# EAGLE design M119B (EAGLE 6.6.0)
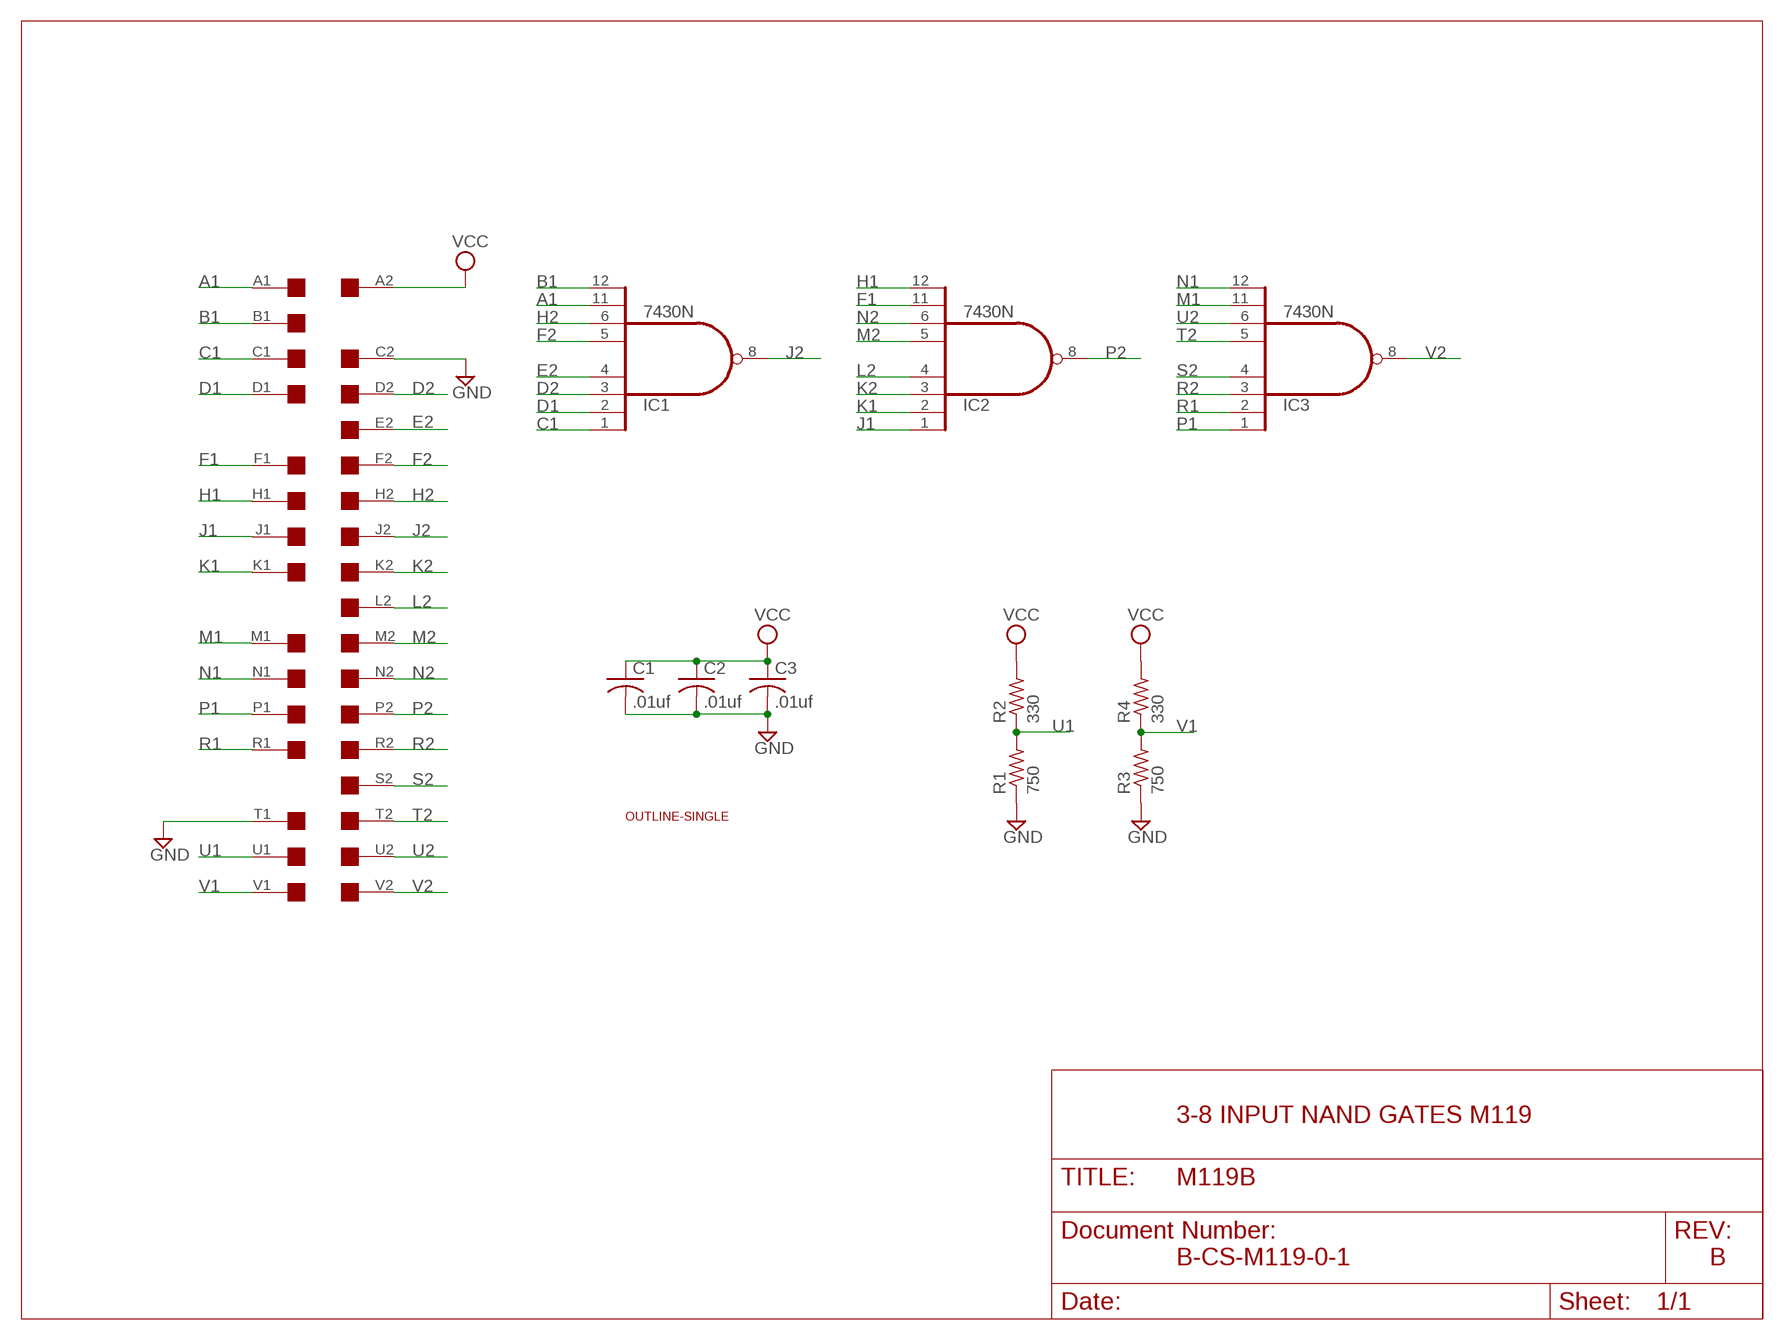
[diagram p0: schematic, sheet 1]

## Parts
C1  .01uf  C-US050-025X075  [C050-025X075]
C2  .01uf  C-US050-025X075  [C050-025X075]
C3  .01uf  C-US050-025X075  [C050-025X075]
IC1  7430N  [DIL14]
IC2  7430N  [DIL14]
IC3  7430N  [DIL14]
R1  750  R-US_0207/10  [0207/10]
R2  330  R-US_0207/10  [0207/10]
R3  750  R-US_0207/10  [0207/10]
R4  330  R-US_0207/10  [0207/10]
U$1  OUTLINE-SINGLE  [SINGLE]
U$4  SINGLE  [EDGE-CON2]

## Nets
A1: IC1.11(I6) U$4.A1
B1: IC1.12(I7) U$4.B1
C1: IC1.1(I0) U$4.C1
D1: IC1.2(I1) U$4.D1
D2: IC1.3(I2) U$4.D2
E2: IC1.4(I3) U$4.E2
F1: IC2.11(I6) U$4.F1
F2: IC1.5(I4) U$4.F2
GND [Supply]: C1.2 C2.2 C3.2 R1.1 R3.1 U$4.C2 U$4.T1
H1: IC2.12(I7) U$4.H1
H2: IC1.6(I5) U$4.H2
J1: IC2.1(I0) U$4.J1
J2: IC1.8(O) U$4.J2
K1: IC2.2(I1) U$4.K1
K2: IC2.3(I2) U$4.K2
L2: IC2.4(I3) U$4.L2
M1: IC3.11(I6) U$4.M1
M2: IC2.5(I4) U$4.M2
N1: IC3.12(I7) U$4.N1
N2: IC2.6(I5) U$4.N2
P1: IC3.1(I0) U$4.P1
P2: IC2.8(O) U$4.P2
R1: IC3.2(I1) U$4.R1
R2: IC3.3(I2) U$4.R2
S2: IC3.4(I3) U$4.S2
T2: IC3.5(I4) U$4.T2
U1: R1.2 R2.1 U$4.U1
U2: IC3.6(I5) U$4.U2
V1: R3.2 R4.1 U$4.V1
V2: IC3.8(O) U$4.V2
VCC [Supply]: C1.1 C2.1 C3.1 R2.2 R4.2 U$4.A2
Unconnected: U$4.B2 U$4.E1 U$4.L1 U$4.S1

## Notes on the sheet
- 3-8 INPUT NAND GATES M119
- B-CS-M119-0-1 | B

## Power pins joined to a net without a drawn wire
GND: IC1.7(GND) IC2.7(GND) IC3.7(GND)
VCC: IC1.14(VCC) IC2.14(VCC) IC3.14(VCC)

## Library data of the parts
C1-C3 = rcl:C-US: CAPACITOR, American symbol
IC1-IC3 = 74xx-us:74*30: 8-input NAND gate
R1-R4 = rcl:R-US_: RESISTOR, American symbol
U$1 = dec-con:OUTLINE-*: Board outlines for DEC boards.
U$4 = dec-con:SINGLE: Single-Height DEC board

## Net classes
1 Supply: width 0.813 mm

## Board
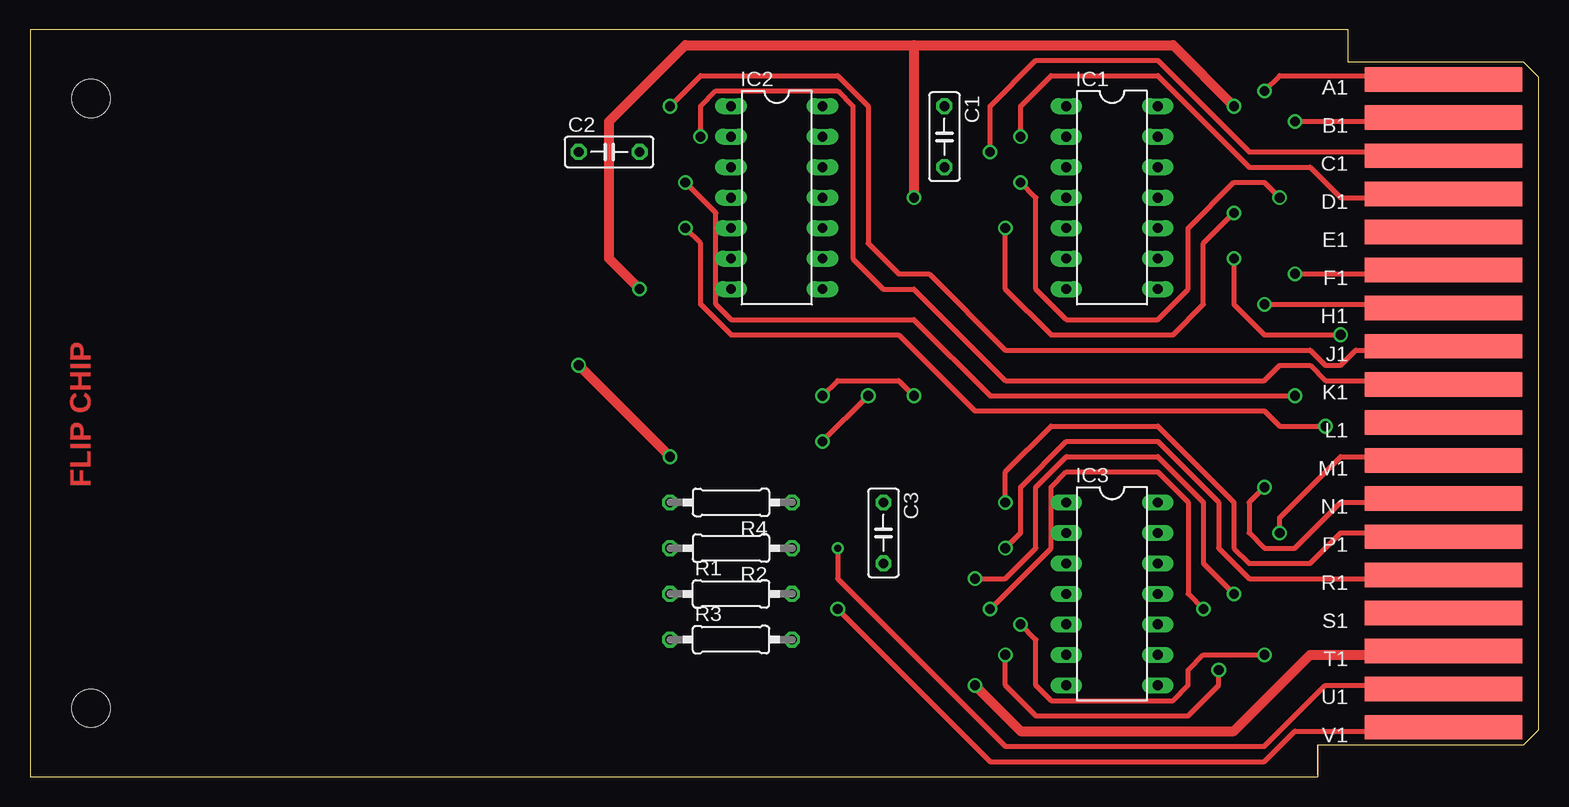
[diagram p1: board, top side]
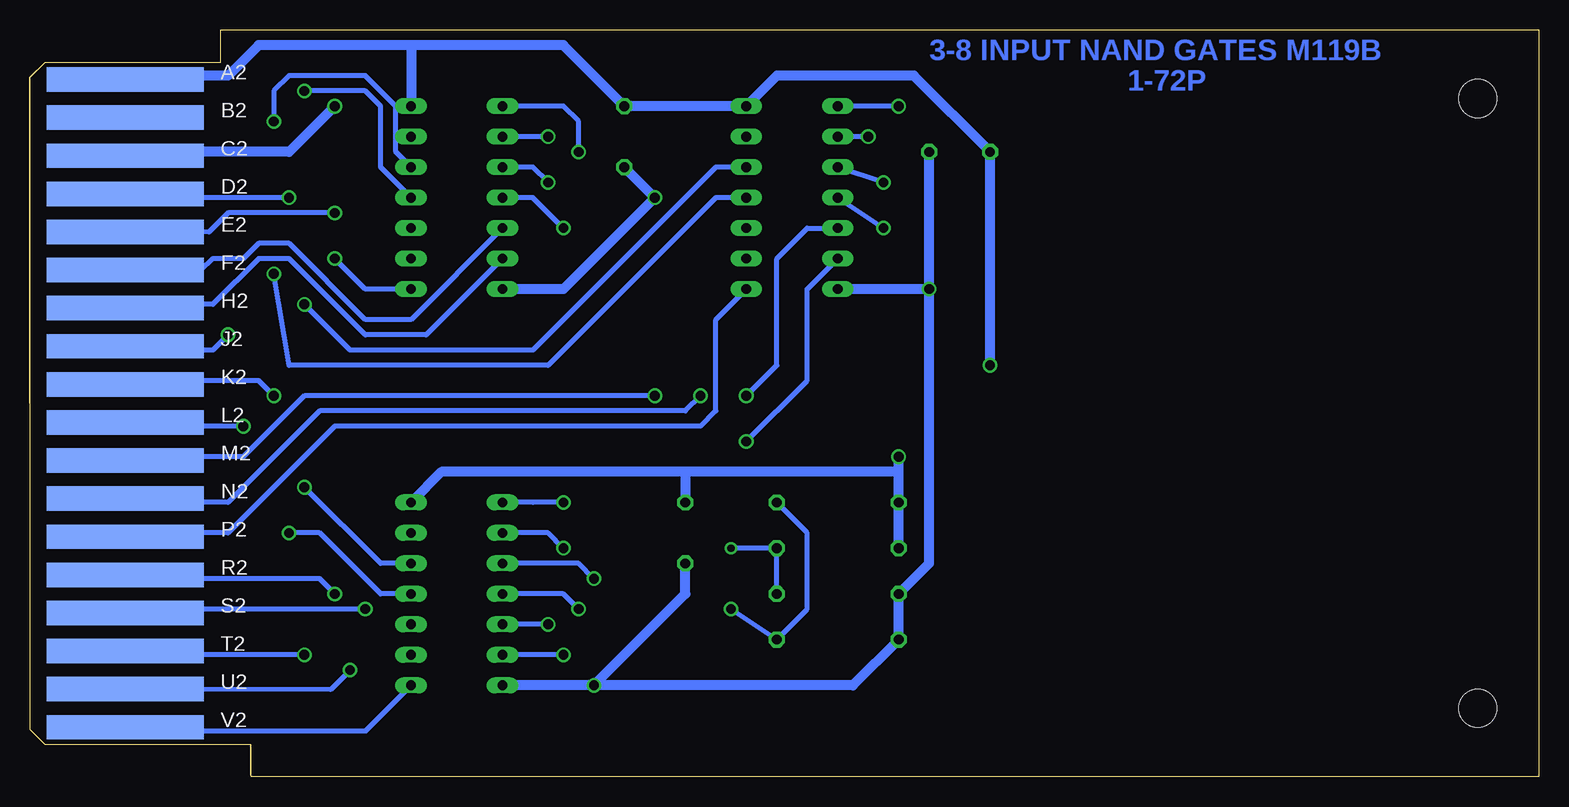
[diagram p2: board, bottom side, seen from below]

Size 125.73 x 62.23 mm. Coordinates in mm from the lower left corner, seen from the top.
Copper layers (1+16): Top 0.035mm / dielectric 1.5mm / Bottom 0.035mm
Design rules "16mils": minimum track width 16mil, minimum drill 32mil, track to track 15mil, track to pad 10mil, pad to pad 10mil, via to via 10mil, smd to smd 10mil, copper to edge 13mil, drill to drill 10mil, minimum pad ring 10mil, minimum via ring 8mil, stop-mask expansion 0mil, vias tented up to drill 0mil, thermal gap 10mil

### Footprints (pad centres in the part's own frame; a part is rotated, then mirrored left to right if it is on the bottom)
C050-025X075 = drill 0.813 octagon: 1 -2.54,0; 2 2.54,0
DIL14 = drill 0.813 long: 1 -7.62,-3.81; 2 -5.08,-3.81; 3 -2.54,-3.81; 4 0,-3.81; 5 2.54,-3.81; 6 5.08,-3.81; 7 7.62,-3.81; 8 7.62,3.81; 9 5.08,3.81; 10 2.54,3.81; 11 0,3.81; 12 -2.54,3.81; 13 -5.08,3.81; 14 -7.62,3.81
0207/10 = drill 0.813 octagon: 1 -5.08,0; 2 5.08,0
SINGLE = hole 3.175: 120.65,56.515; 120.65,5.715
EDGE-CON2 = smd 13.106 x 2.032: A1 7.938,4.128; B1 7.938,7.303; C1 7.938,10.477; D1 7.938,13.652; E1 7.938,16.828; F1 7.938,20.003; H1 7.938,23.177; J1 7.938,26.352; K1 7.938,29.527; L1 7.938,32.703; M1 7.938,35.877; N1 7.938,39.053; P1 7.938,42.227; R1 7.938,45.403; S1 7.938,48.578; T1 7.938,51.752; U1 7.938,54.928; V1 7.938,58.102 | smd 13.106 x 2.032 bottom: A2 7.938,4.128; B2 7.938,7.303; C2 7.938,10.477; D2 7.938,13.652; E2 7.938,16.828; F2 7.938,20.003; H2 7.938,23.177; J2 7.938,26.352; K2 7.938,29.527; L2 7.938,32.703; M2 7.938,35.877; N2 7.938,39.053; P2 7.938,42.227; R2 7.938,45.403; S2 7.938,48.578; T2 7.938,51.752; U2 7.938,54.928; V2 7.938,58.102

### Placement (x,y rotation side)
C1  76.2,53.34 270 top
C2  48.26,52.07 0 top
C3  71.12,20.32 270 top
IC1  90.17,48.26 270 top
IC2  62.23,48.26 270 top
IC3  90.17,15.24 270 top
R1  58.42,15.24 0 top
R2  58.42,19.05 180 top
R3  58.42,11.43 0 top
R4  58.42,22.86 180 top
U$1  125.73,62.23 180 top
U$4  125.73,62.23 180 top

### Tracks (layer width: path | path; a pad name or v marks a point on that pad's centre or on a via)
A1  (via drill 0.81)
  Top 0.406: U$4.A1 112.16,58.02 111.76,58.42 104.14,58.42 v102.87,57.15
  Bottom 0.406: v102.87,57.15 97.79,57.15 96.52,55.88 96.52,50.8 IC1.11
B1  (via drill 0.81)
  Top 0.406: U$4.B1 112.05,54.9 111.76,54.61 v105.41,54.61
  Bottom 0.406: v105.41,54.61 105.41,57.15 104.14,58.42 97.79,58.42 95.25,55.88 95.25,52.07 IC1.12
C1  (via drill 0.81)
  Top 0.406: U$4.C1 112.09,51.74 111.76,52.07 101.6,52.07 93.98,59.69 83.82,59.69 80.01,55.88 80.01,54.61 v80.01,52.07
  Bottom 0.406: v80.01,52.07 80.01,54.61 81.28,55.88 IC1.1
D1  (via drill 0.81)
  Top 0.406: U$4.D1 112.06,48.56 111.76,48.26 109.22,48.26 106.68,50.8 101.6,50.8 93.98,58.42 85.09,58.42 82.55,55.88 v82.55,53.34
  Bottom 0.406: v82.55,53.34 IC1.2
D2  (via drill 0.81)
  Top 0.406: v82.55,49.53 83.82,48.26 83.82,40.64 86.36,38.1 93.98,38.1 96.52,40.64 96.52,45.72 100.33,49.53 102.87,49.53 v104.14,48.26
  Bottom 0.406: IC1.3 83.82,50.8 v82.55,49.53 | U$4.D2 112.06,48.56 111.76,48.26 v104.14,48.26
E2  (via drill 0.81)
  Top 0.406: v81.28,45.72 81.28,40.64 85.09,36.83 95.25,36.83 97.79,39.37 97.79,44.45 v100.33,46.99
  Bottom 0.406: IC1.4 83.82,48.26 v81.28,45.72 | U$4.E2 110.82,45.39 109.22,46.99 v100.33,46.99
F1  (via drill 0.81)
  Top 0.406: U$4.F1 112.04,42.19 111.76,41.91 v105.41,41.91
  Bottom 0.406: IC2.11 68.58,48.26 82.55,34.29 104.14,34.29 v105.41,41.91
F2
  Bottom 0.406: IC1.5 93.98,38.1 97.79,38.1 104.14,44.45 106.68,44.45 107.95,43.18 110.49,43.18 111.48,42.19 U$4.F2
GND  (via drill 0.81)
  Top 0.813: v100.33,55.88 95.25,60.96 73.66,60.96 | 73.66,60.96 v73.66,48.26 | 73.66,60.96 54.61,60.96 48.26,54.61 48.26,43.18 v50.8,40.64 | U$4.T1 112.09,10.49 111.76,10.16 106.68,10.16 100.33,3.81 82.55,3.81 v78.74,7.62
  Bottom 0.813: U$4.C2 112.09,51.74 111.76,52.07 104.14,52.07 v100.33,55.88 | C1.2 v73.66,48.26 81.28,40.64 IC1.7 | v50.8,40.64 IC2.7 | v50.8,40.64 C2.2 | R3.1 R1.1 | R1.1 50.8,17.78 v50.8,40.64 | R3.1 R1.1 | R3.1 57.15,7.62 v78.74,7.62 | v78.74,7.62 IC3.7 | v78.74,7.62 71.12,15.24 C3.2
H1  (via drill 0.81)
  Top 0.406: U$4.H1 112.09,39.04 111.76,39.37 v102.87,39.37
  Bottom 0.406: IC2.12 68.58,50.8 83.82,35.56 99.06,35.56 v102.87,39.37
H2
  Bottom 0.406: IC1.6 92.71,36.83 97.79,36.83 104.14,43.18 106.68,43.18 110.49,39.37 111.76,39.37 112.09,39.04 U$4.H2
J1  (via drill 0.81)
  Top 0.406: v53.34,55.88 55.88,58.42 67.31,58.42 69.85,55.88 69.85,44.45 72.39,41.91 74.93,41.91 81.28,35.56 106.68,35.56 107.95,34.29 109.22,34.29 110.49,35.56 117.76,35.56 U$4.J1
  Bottom 0.406: v53.34,55.88 IC2.1
J2  (via drill 0.81)
  Top 0.406: v100.33,43.18 100.33,39.37 102.87,36.83 v109.22,36.83
  Bottom 0.406: IC1.8 97.79,40.64 v100.33,43.18 | U$4.J2 112.09,35.89 111.76,35.56 110.49,35.56 v109.22,36.83
K1  (via drill 0.81)
  Top 0.406: v55.88,53.34 55.88,55.88 57.15,57.15 67.31,57.15 68.58,55.88 68.58,43.18 71.12,40.64 73.66,40.64 81.28,33.02 102.87,33.02 104.14,34.29 106.68,34.29 107.95,33.02 112.7,33.02 U$4.K1
  Bottom 0.406: v55.88,53.34 IC2.2
K2  (via drill 0.81)
  Top 0.406: v54.61,49.53 57.15,46.99 57.15,39.37 58.42,38.1 73.66,38.1 80.01,31.75 v105.41,31.75
  Bottom 0.406: v54.61,49.53 IC2.3 | U$4.K2 117.78,33.02 106.68,33.02 v105.41,31.75
L2  (via drill 0.81)
  Top 0.406: v54.61,45.72 55.88,44.45 55.88,39.37 58.42,36.83 72.39,36.83 78.74,30.48 102.87,30.48 104.14,29.21 v107.95,29.21
  Bottom 0.406: v54.61,45.72 IC2.4 | U$4.L2 117.76,29.21 v107.95,29.21
M1  (via drill 0.81)
  Top 0.406: U$4.M1 112.09,26.34 111.76,26.67 109.22,26.67 104.14,21.59 v104.14,20.32
  Bottom 0.406: IC3.11 96.52,15.24 101.6,20.32 v104.14,20.32
M2  (via drill 0.81)
  Top 0.406: v66.04,31.75 67.31,33.02 72.39,33.02 v73.66,31.75
  Bottom 0.406: IC2.5 60.96,45.72 63.5,43.18 63.5,34.29 v66.04,31.75 | U$4.M2 112.09,26.34 111.76,26.67 107.95,26.67 102.87,31.75 v73.66,31.75
N1  (via drill 0.81)
  Top 0.406: U$4.N1 117.76,22.86 109.22,22.86 105.41,19.05 102.87,19.05 101.6,20.32 101.6,22.86 v102.87,24.13
  Bottom 0.406: IC3.12 96.52,17.78 v102.87,24.13
N2  (via drill 0.81)
  Top 0.406: v66.04,27.94 v69.85,31.75
  Bottom 0.406: IC2.6 60.96,40.64 60.96,33.02 v66.04,27.94 | U$4.N2 112.09,23.19 111.76,22.86 109.22,22.86 101.6,30.48 71.12,30.48 v69.85,31.75
P1  (via drill 0.81)
  Top 0.406: U$4.P1 112.09,19.99 111.76,20.32 109.22,20.32 106.68,17.78 101.6,17.78 100.33,19.05 100.33,22.86 93.98,29.21 85.09,29.21 81.28,25.4 v81.28,22.86
  Bottom 0.406: IC3.1 83.82,22.86 v81.28,22.86
P2
  Bottom 0.406: U$4.P2 112.09,19.99 111.76,20.32 109.22,20.32 100.33,29.21 69.85,29.21 68.58,30.48 68.58,38.1 IC2.8
R1  (via drill 0.81)
  Top 0.406: U$4.R1 112.09,16.84 111.76,16.51 101.6,16.51 99.06,19.05 99.06,22.86 93.98,27.94 86.36,27.94 82.55,24.13 82.55,20.32 v81.28,19.05
  Bottom 0.406: v81.28,19.05 82.55,20.32 IC3.2
R2  (via drill 0.81)
  Top 0.406: v100.33,15.24 97.79,17.78 97.79,22.86 93.98,26.67 86.36,26.67 83.82,24.13 83.82,19.05 81.28,16.51 v78.74,16.51
  Bottom 0.406: IC3.3 80.01,17.78 v78.74,16.51 | U$4.R2 112.09,16.84 111.76,16.51 101.6,16.51 v100.33,15.24
S2  (via drill 0.81)
  Top 0.406: v97.79,13.97 96.52,15.24 96.52,22.86 93.98,25.4 86.36,25.4 85.09,24.13 85.09,19.05 v80.01,13.97
  Bottom 0.406: v80.01,13.97 81.28,15.24 IC3.4 | U$4.S2 112.06,13.66 111.76,13.97 v97.79,13.97
T2  (via drill 0.81)
  Top 0.406: v102.87,10.16 97.79,10.16 96.52,8.89 96.52,7.62 95.25,6.35 85.09,6.35 83.82,7.62 83.82,11.43 v82.55,12.7
  Bottom 0.406: v82.55,12.7 IC3.5 | U$4.T2 112.09,10.49 111.76,10.16 v102.87,10.16
U1  (via drill 0.61)
  Top 0.406: U$4.U1 111.76,7.62 107.95,7.62 102.87,2.54 81.28,2.54 67.31,16.51 v67.31,19.05
  Bottom 0.406: R1.2 R2.1 v67.31,19.05
U2  (via drill 0.81)
  Top 0.406: v99.06,8.89 99.06,7.62 96.52,5.08 83.82,5.08 81.28,7.62 v81.28,10.16
  Bottom 0.406: v81.28,10.16 IC3.6 | U$4.U2 100.69,7.26 v99.06,8.89
V1  (via drill 0.81)
  Top 0.406: U$4.V1 111.76,3.81 105.41,3.81 102.87,1.27 80.01,1.27 v67.31,13.97
  Bottom 0.406: R4.1 60.96,20.32 60.96,13.97 R3.2 v67.31,13.97
V2
  Bottom 0.406: U$4.V2 112.15,4.2 111.76,3.81 97.79,3.81 IC3.8
VCC  (via drill 0.81)
  Top 0.813: v53.34,26.67 v45.72,34.29
  Bottom 0.813: R2.2 R4.2 53.34,25.4 | 53.34,25.4 v53.34,26.67 | v45.72,34.29 C2.1 52.07,58.42 63.5,58.42 IC2.14 C1.1 81.28,60.96 93.98,60.96 | 71.12,25.4 C3.1 | 53.34,25.4 71.12,25.4 | IC3.14 91.44,25.4 71.12,25.4 | U$4.A2 111.76,58.42 109.22,58.42 106.68,60.96 93.98,60.96 | 93.98,60.96 IC1.14

### Text on the board
Top: FLIP CHIP
Bottom: 3-8 INPUT NAND GATES M119B | 1-72P